# Altium schematic sheet TempAndHum.SchDoc
size A4
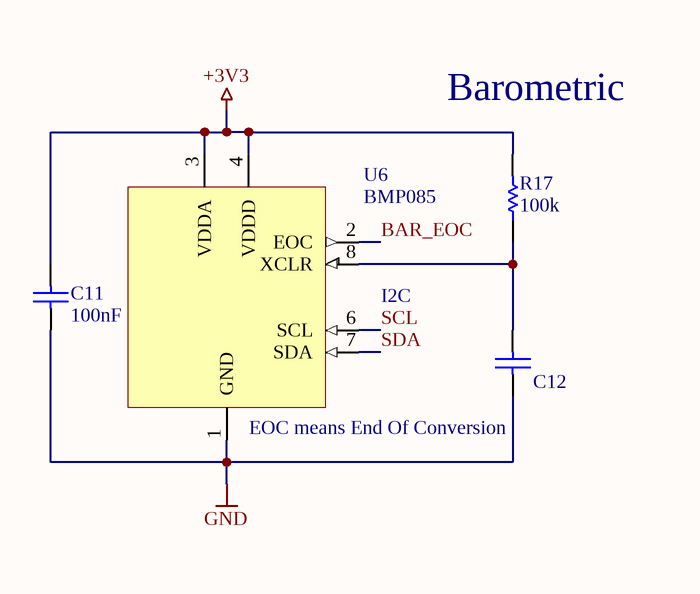
[diagram p0: TempAndHum.SchDoc]

## Parts
C11  value 100nF  [CAPC0805(2012)100_M]  (hidden comment: CAP 100nF 10V 0805(2012))
C12  CAP 10nF 10V 0805(2012)  [CAPC0805(2012)100_L]  (value not drawn)
R17  100k  [6-0805]
U6  BMP085  [BMP085]

## Nets
+3V3: C11.2 R17.2 U6.3(VDDA) U6.4(VDDD)
GND: C11.1 C12.1 U6.1(GND)
BAR_EOC: U6.2(EOC)
SCL: U6.6(SCL)
SDA: U6.7(SDA)
NetC12_2: C12.2 R17.1 U6.8(XCLR)

## Notes on the sheet
- (near R17) Barometric
- (near U6) I2C
- (near U6) EOC means End Of Conversion

## Library data of the parts
C11 = CMP-1036-04394-1: CAP 100nF 10V ±10% 0805 (2012 Metric) Thickness 1mm SMD; Case-EIA: 0805; Case-Metric: 2012; Tolerance: ±10%; Max Thickness: 1 mm; Technology: SMT; Rated Voltage: 10 V
C12 = CMP-1036-03809-1: CAP 10nF 10V ±10% 0805 (2012 Metric) Thickness 1mm SMD; Case-EIA: 0805; Case-Metric: 2012; Rated Voltage: 10 V; Tolerance: ±10%; Value: 10nF; Technology: SMT; Max Thickness: 1 mm
R17 = ERJ6RB: Precision Thick Film Chip Resistor, 10 Ohm to 1M Ohm Range, 1% and 0.5% Tolerance, 0805 Size, 0.1 W; Published: 17-Dec-2003; LatestRevisionDate: 19-Mar-2004; LatestRevisionNote: Silkscreen size reduced.; PackageDocument: Mar-2003; PackageReference: 6-0805; Publisher: Altium Limited; Code_IPC: 2012 [0805]; ComponentLink1Description: Manufacturer Link; ComponentLink1URL: http://www.panasonic.com/industrial/components/resistive_products.htm; ComponentLink2Description: Datasheet; ComponentLink2URL: http://www.panasonic.com/industrial/components/pdf/AOA0000CE2.pdf